# EAGLE design FidoComm (EAGLE 7.2.0)
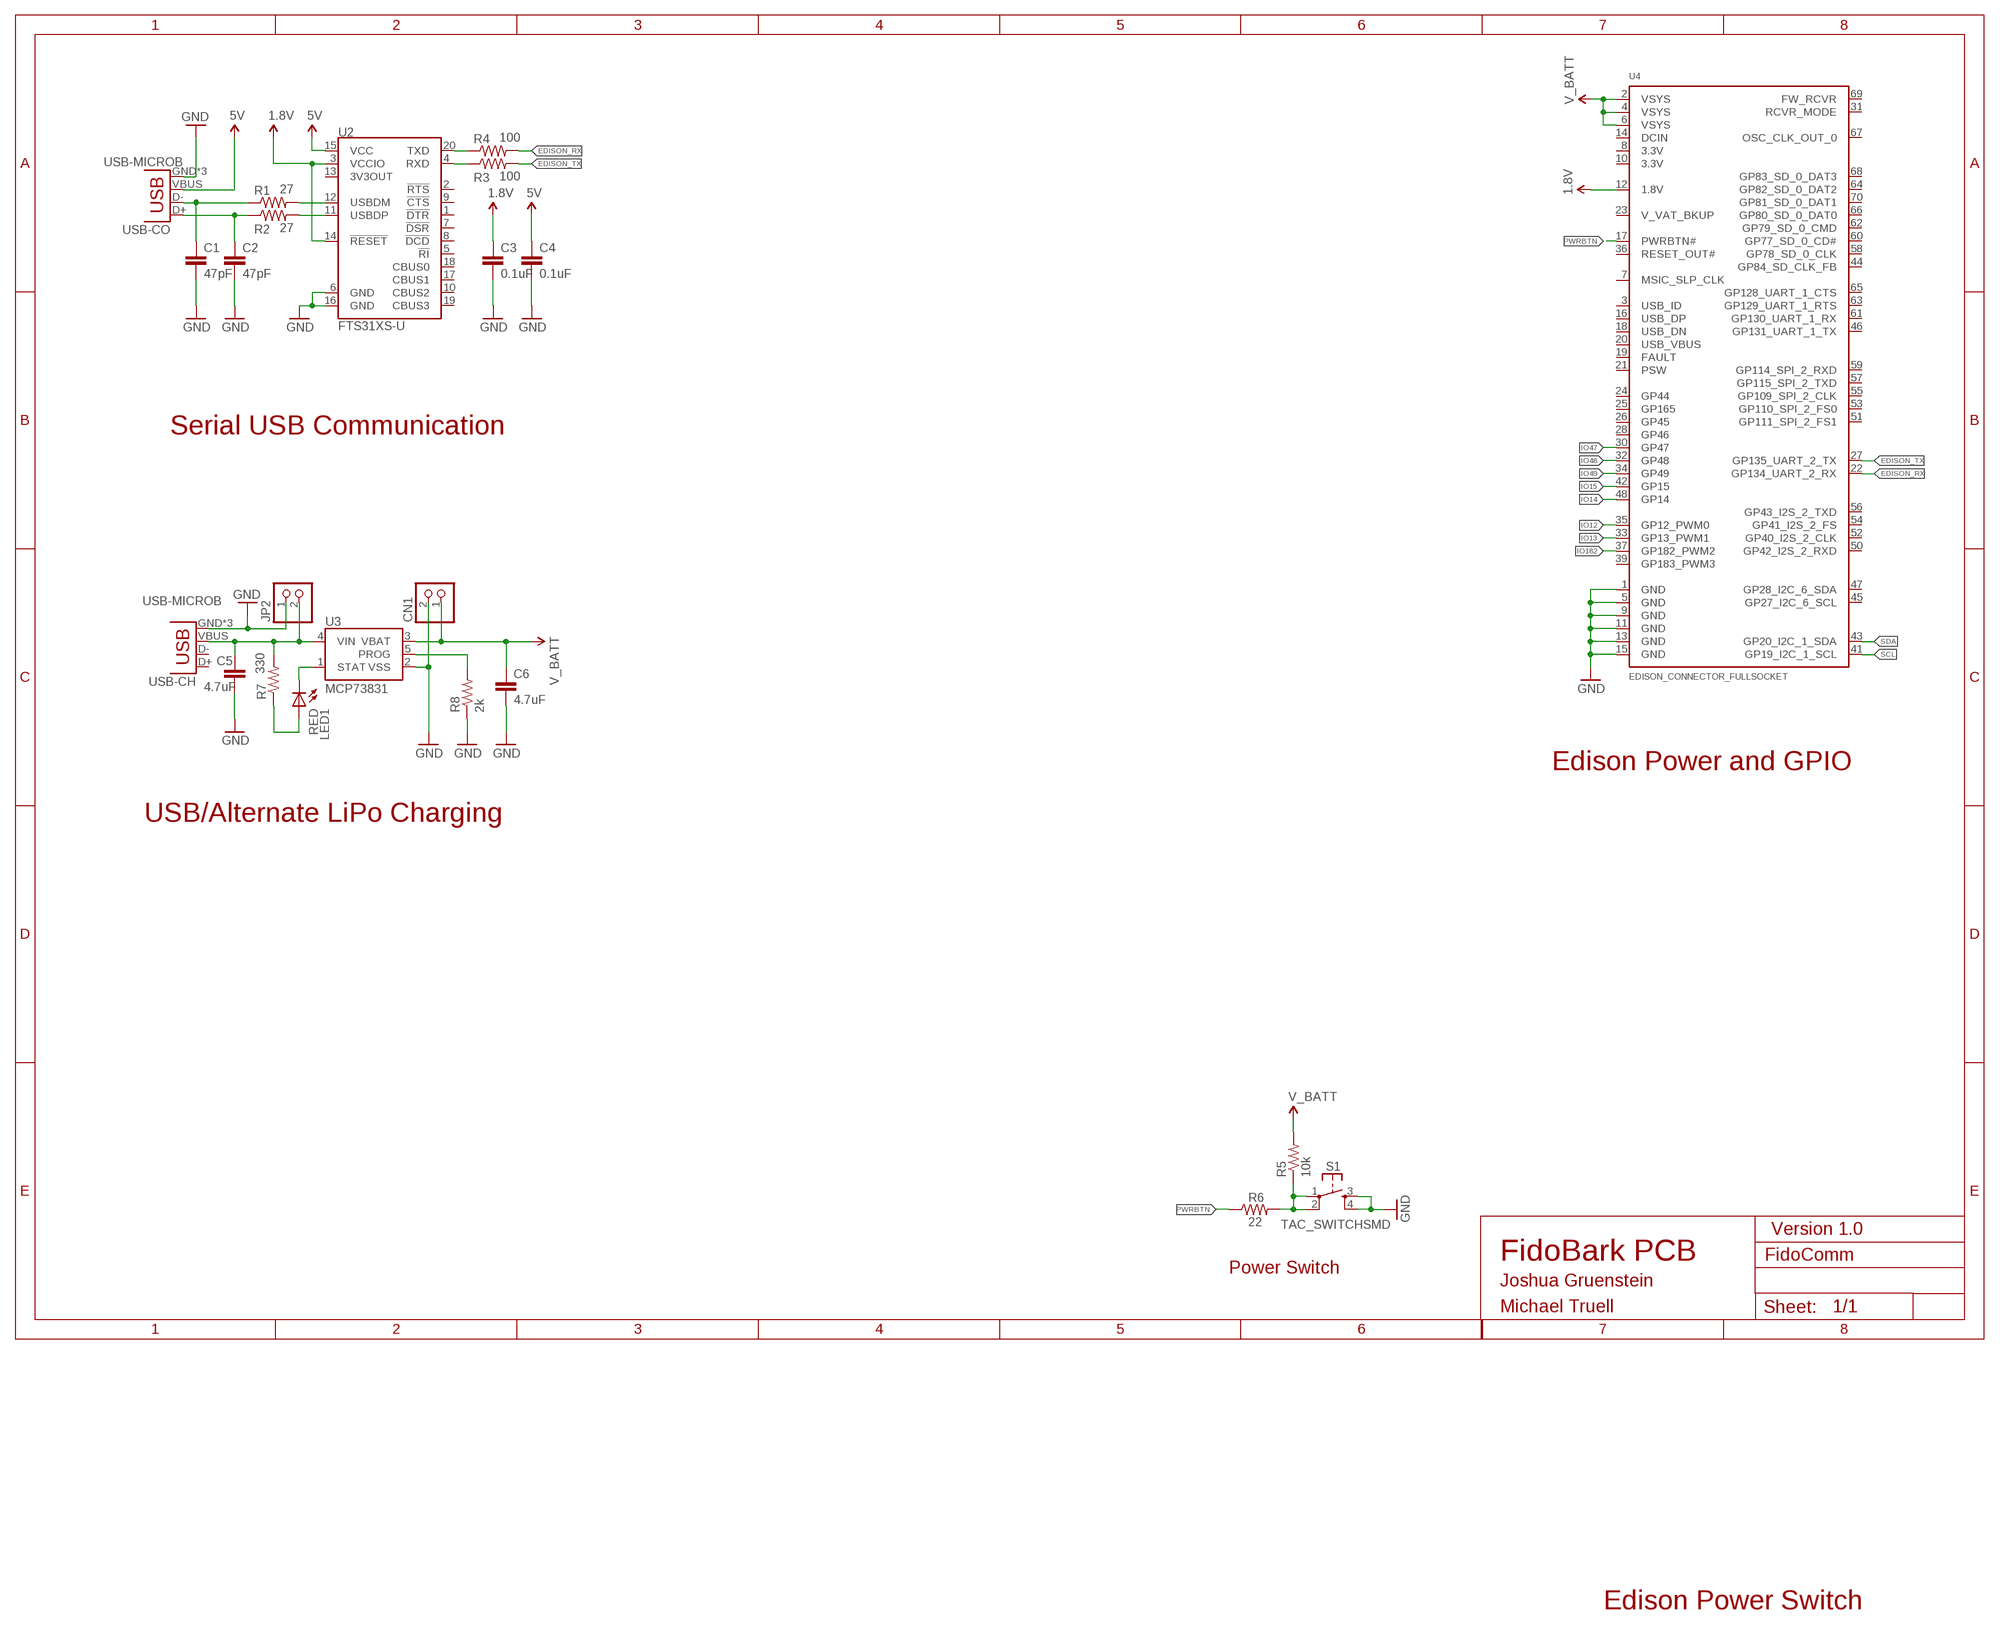
[diagram p0: schematic, sheet 1]

## Parts
C1  47pF  CAP0603-CAP  [0603-CAP]
C2  47pF  CAP0603-CAP  [0603-CAP]
C3  0.1uF  CAP0603-CAP  [0603-CAP]
C4  0.1uF  CAP0603-CAP  [0603-CAP]
C5  4.7uF  CAP0603-CAP  [0603-CAP]
C6  4.7uF  CAP0603-CAP  [0603-CAP]
CN1  JST_2PIN-SMT-RA  [JST-PH-2-SMT-RA]
JP2  PINHD-1X2  [1X02]
LED1  RED  LEDCHIP-LED0603  [CHIP-LED0603]
R1  27  R-US_R0603  [R0603]
R2  27  R-US_R0603  [R0603]
R3  100  R-US_R0603  [R0603]
R4  100  R-US_R0603  [R0603]
R5  10k  R-US_R0603  [R0603]
R6  22  R-US_R0603  [R0603]
R7  330  R-US_R0603  [R0603]
R8  2k  R-US_R0603  [R0603]
S1  TAC_SWITCHSMD  [TACTILE-SWITCH-SMD]
U2  FTS31XS-U  FT231XS  [SSOP20_L]
U3  MCP73831  [SOT23-5]
U4  EDISON_CONNECTOR_FULLSOCKET  [DF40-XC-(X.X)-70DS-0.4V(51)]
USB-CH  USB-MICROB  [USB-MICROB]
USB-CO  USB-MICROB  [USB-MICROB]

## Nets
1.8V: C3.1 U2.3(VCCIO) U2.14(!RESET) U4.12(1.8V)
5V: C4.1 U2.15(VCC) USB-CO.VBUS
EDISON_RX: R4.2 U4.22(GP134_UART_2_RX)
EDISON_TX: R3.2 U4.27(GP135_UART_2_TX)
GND: C1.2 C2.2 C3.2 C4.2 C5.2 C6.2 CN1.2 JP2.1 R8.1 S1.3 S1.4 U2.6(GND) U2.16(GND) U3.2(VSS) U4.1(GND) U4.5(GND) U4.9(GND) U4.11(GND) U4.13(GND) U4.15(GND) USB-CH.GND USB-CH.MT1(GND) USB-CH.MT2(GND) USB-CO.GND USB-CO.MT1(GND) USB-CO.MT2(GND)
IO12: U4.35(GP12_PWM0)
IO13: U4.33(GP13_PWM1)
IO14: U4.48(GP14)
IO15: U4.42(GP15)
IO47: U4.30(GP47)
IO48: U4.32(GP48)
IO49: U4.34(GP49)
IO182: U4.37(GP182_PWM2)
N$1: R2.2 U2.11(USBDP)
N$2: R1.2 U2.12(USBDM)
N$3: R3.1 U2.4(RXD)
N$4: C2.1 R2.1 USB-CO.D+
N$5: C1.1 R1.1 USB-CO.D-
N$6: R4.1 U2.20(TXD)
N$7: R5.1 R6.2 S1.1 S1.2
N$8: LED1.A R7.1
N$9: LED1.C U3.1(STAT)
N$10: R8.2 U3.5(PROG)
N$12: C5.1 JP2.2 R7.2 U3.4(VIN) USB-CH.VBUS
PWRBTN: R6.1 U4.17(PWRBTN#)
SCL: U4.41(GP19_I2C_1_SCL)
SDA: U4.43(GP20_I2C_1_SDA)
V_BATT: C6.1 CN1.1 R5.2 U3.3(VBAT) U4.2(VSYS) U4.4(VSYS) U4.6(VSYS)
Unconnected: U2.1(!DTR) U2.2(!RTS) U2.5(!RI) U2.7(!DSR) U2.8(!DCD) U2.9(!CTS) U2.10(CBUS2) U2.13(3V3OUT) U2.17(CBUS1) U2.18(CBUS0) U2.19(CBUS3) U4.3(USB_ID) U4.7(MSIC_SLP_CLK) U4.8(3.3V) U4.10(3.3V) U4.14(DCIN) U4.16(USB_DP) U4.18(USB_DN) U4.19(FAULT) U4.20(USB_VBUS) U4.21(PSW) U4.23(V_VAT_BKUP) U4.24(GP44) U4.25(GP165) U4.26(GP45) U4.28(GP46) U4.31(RCVR_MODE) U4.36(RESET_OUT#) U4.39(GP183_PWM3) U4.44(GP84_SD_CLK_FB) U4.45(GP27_I2C_6_SCL) U4.46(GP131_UART_1_TX) U4.47(GP28_I2C_6_SDA) U4.50(GP42_I2S_2_RXD) U4.51(GP111_SPI_2_FS1) U4.52(GP40_I2S_2_CLK) U4.53(GP110_SPI_2_FS0) U4.54(GP41_I2S_2_FS) U4.55(GP109_SPI_2_CLK) U4.56(GP43_I2S_2_TXD) U4.57(GP115_SPI_2_TXD) U4.58(GP78_SD_0_CLK) U4.59(GP114_SPI_2_RXD) U4.60(GP77_SD_0_CD#) U4.61(GP130_UART_1_RX) U4.62(GP79_SD_0_CMD) U4.63(GP129_UART_1_RTS) U4.64(GP82_SD_0_DAT2) U4.65(GP128_UART_1_CTS) U4.66(GP80_SD_0_DAT0) U4.67(OSC_CLK_OUT_0) U4.68(GP83_SD_0_DAT3) U4.69(FW_RCVR) U4.70(GP81_SD_0_DAT1) USB-CH.D+ USB-CH.D-

## Notes on the sheet
- Serial USB Communication
- Edison Power and GPIO
- USB/Alternate LiPo Charging
- Version 1.0
- FidoBark PCB
- Power Switch
- Joshua Gruenstein
- Michael Truell
- Edison Power Switch

## Library data of the parts
C1-C6 = SparkFun-Passives:CAP: Capacitor Standard 0603 ceramic capacitor, and 0.1" leaded capacitor.
CN1 = adafruit:JST_2PIN: JST 2-Pin Connectors of various flavors SMT-RA (S2B-PH-SM4) 4UConnector #17311 SMT (B2B-PH-SM4) THM-RA (S2B-PH) THM (B2B-PH)
JP2 = pinhead:PINHD-1X2: PIN HEADER
LED1 = adafruit:LED: LED OSRAM: - CHIPLED LG R971, LG N971, LY N971, LG Q971, LY Q971, LO R971, LY R971 LH N974, LH R974 LS Q976, LO Q976, LY Q976 LO Q996 - Hyper CHIPLED LW Q18S LB Q993, LB Q99A, LB R99A - SideLED LS A670, LO A670, LY A670, LG A670, LP A670 LB A673, LV A673, LT A673, LW A673 LH A674 LY A675 LS A676, LA A676, LO A676, LY A676, LW A676 LS A679, LY A679, LG A679 - Hyper Micro SIDELED® LS Y876, LA Y876, LO Y876, LY Y876 LT Y87S - SmartLED LW L88C, LW L88S LB L89C, LB L89S, LG L890 LS L89K, LO L89K, LY L89K LS L896, LA L896, LO L896, LY L896 - TOPLED LS T670, LO T670, LY T670, LG T670, LP T670 LSG T670, LSP T670, LSY T670, LOP T670, LYG T670 LG T671, LOG T671, LSG T671 LB T673, LV T673, LT T673, LW T673 LH T674 LS T676, LA T676, LO T676, LY T676, LB T676, LH T676, LSB T676, LW T676 LB T67C, LV T67C, LT T67C, LS T67K, LO T67K, LY T67K, LW E67C LS E67B, LA E67B, LO E67B, LY E67B, LB E67C, LV E67C, LT E67C LW T67C LS T679, LY T679, LG T679 LS T770, LO T770, LY T770, LG T770, LP T770 LB T773, LV T773, LT T773, LW T773 LH T774 LS E675, LA E675, LY E675, LS T675 LS T776, LA T776, LO T776, LY T776, LB T776 LHGB T686 LT T68C, LB T68C - Hyper Mini TOPLED® LB M676 - Mini TOPLED Santana® LG M470 LS M47K, LO M47K, LY M47K Source: http://www.osram.convergy.de/
R1-R8 = adafruit:R-US_: RESISTOR, American symbol
S1 = SparkFun-Retired:TAC_SWITCH: Momentary Switch Button commonly used for reset or general input. Spark Fun Electronics SKU : COM-00097 SMT- SWCH-08247; PROD_ID: SWCH-08247
U2 = SparkFun-DigitalIC:FT231X: FTDI FT231X Full Speed USB to Full-handshake UART This USB2.0 Full Speed IC offers a compact bridge to full handshake UART interfaces. The device is a UART, capable of operating up to 3MBaud, with low power consumption (8mA). The FT231X includes the complete FT-X series feature set and enables USB to be added into a system design quickly and easily over a UART interface.; PROD_ID: IC-11524
U3 = SparkFun-PowerIC:MCP73831: Miniature single cell, fully integrated Li-Ion, Li-polymer charge management controller http://ww1.microchip.com/downloads/en/DeviceDoc/20001984g.pdf IC-09995; PROD_ID: IC-09995
U4 = Edison:EDISON_CONNECTOR_FULL
USB-CH USB-CO = SparkFun-Connectors:USB: USB Connectors USB-B-PTH is fully proven SKU : PRT-00139/CONN-08278 USB-miniB is fully proven SKU : PRT-00587 USB-A-PCB is untested. USB-A-H is throughly reviewed, but untested. Spark Fun Electronics SKU : PRT-00437 USB-B-SMT is throughly reviewed, but untested. Needs silkscreen touching up. USB-A-S has not been used/tested USB-MB-H has not been used/tested USB-MICROB has been used. CONN-09505; PROD_ID: CONN-09505

## Board
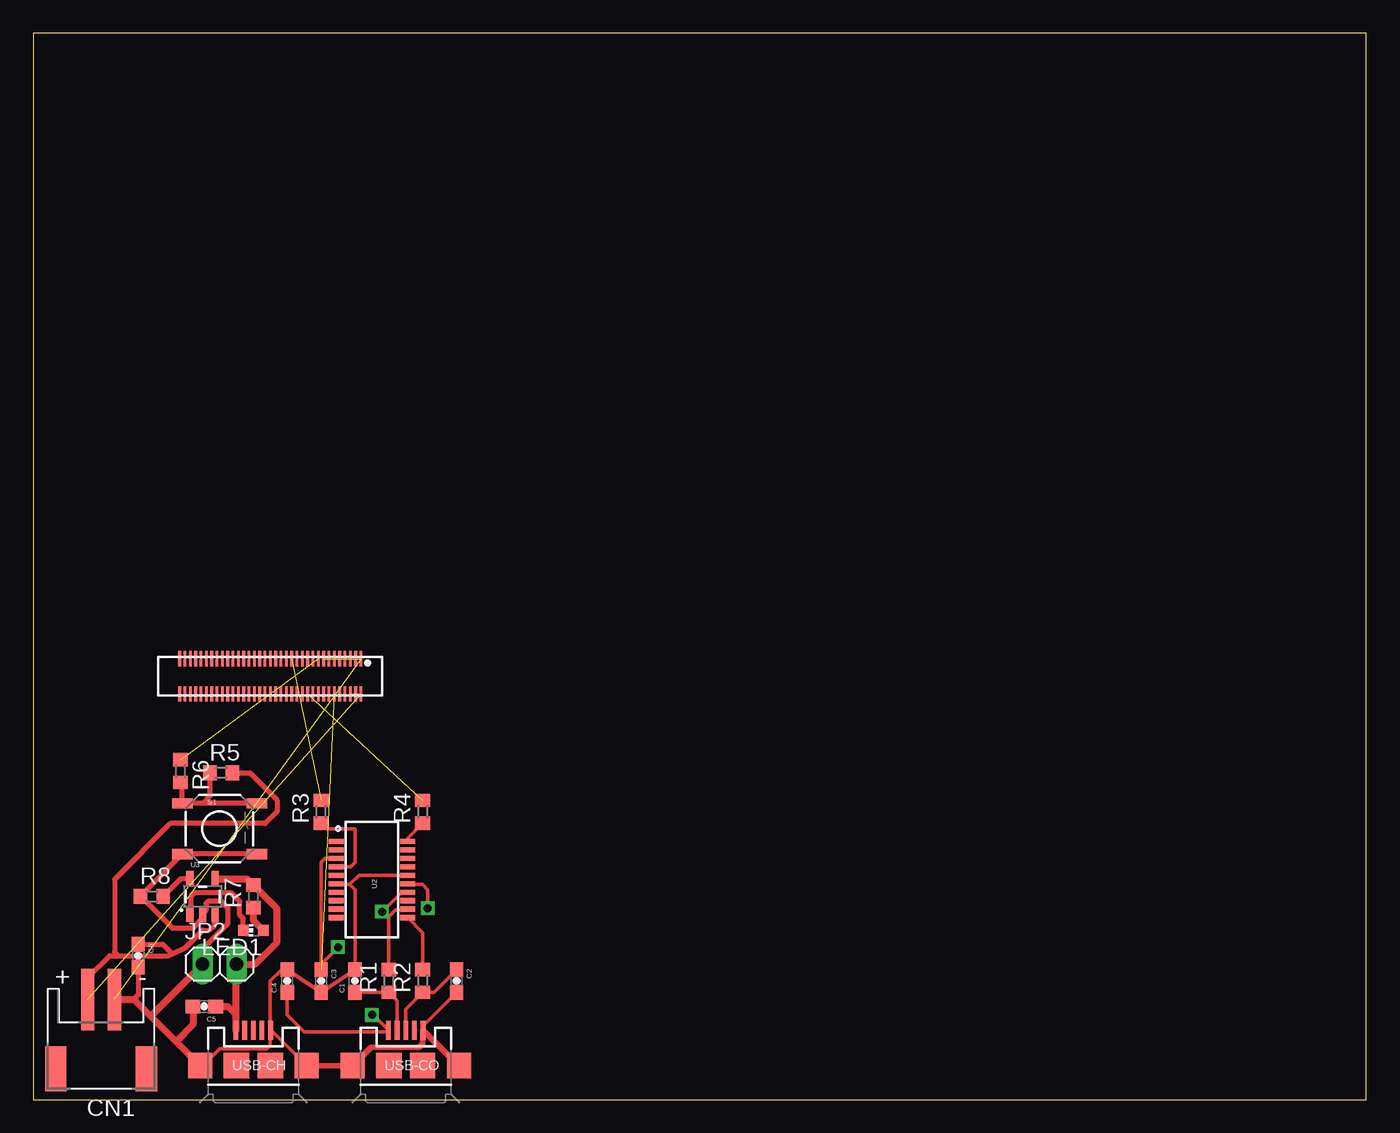
[diagram p1: board, top side]
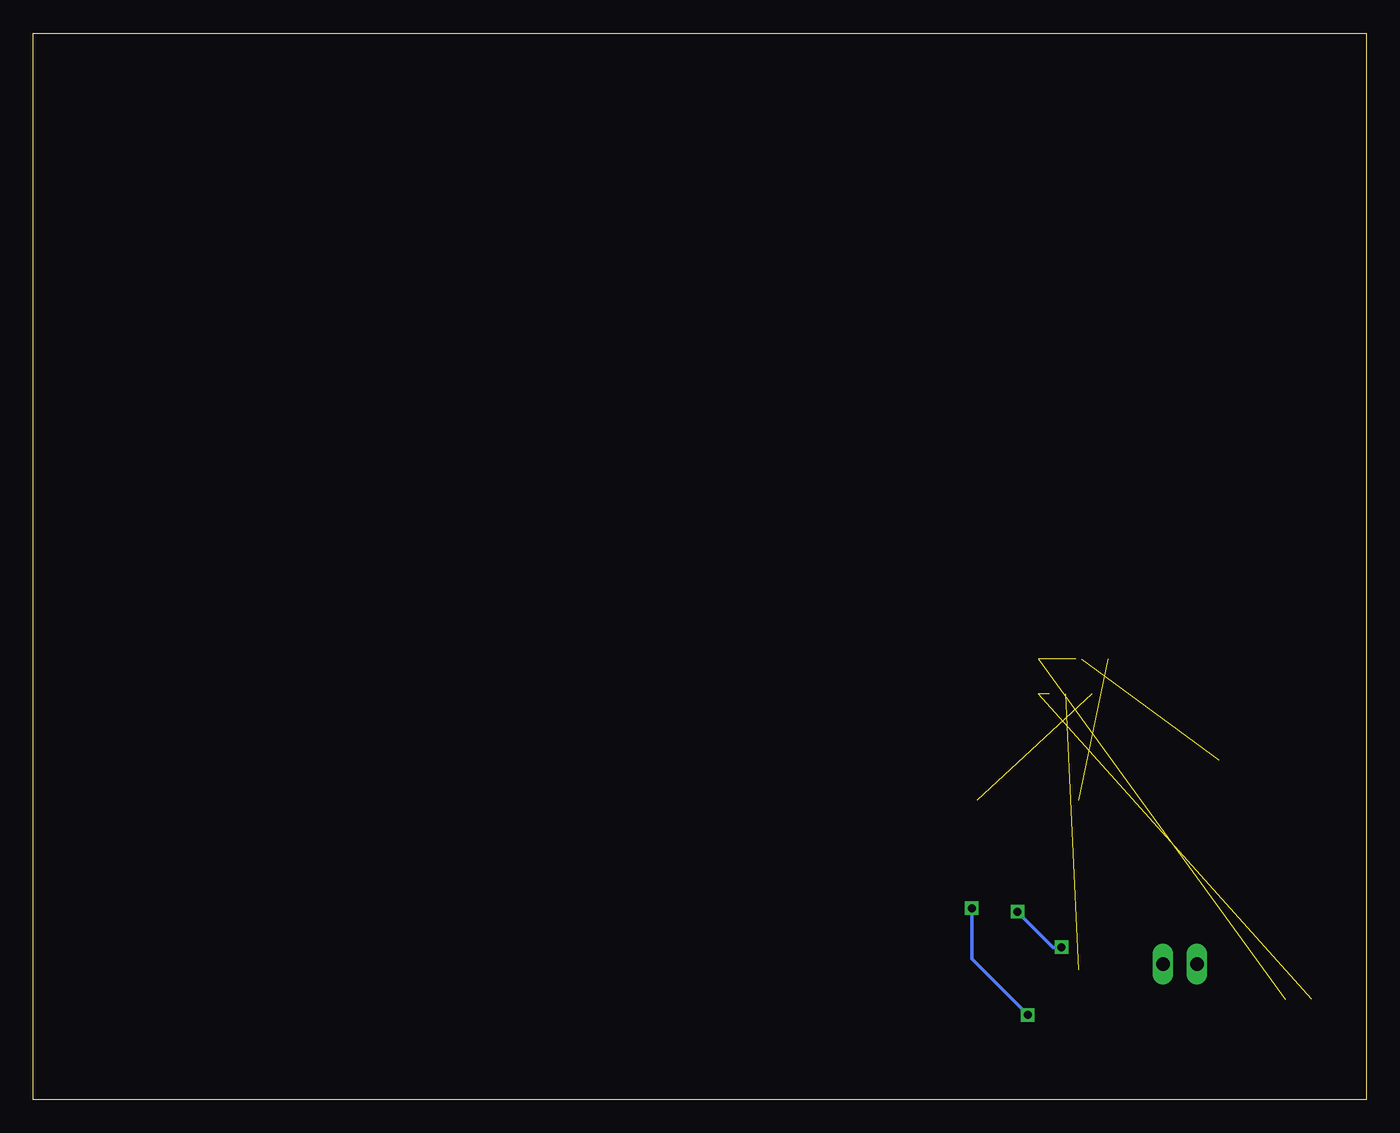
[diagram p2: board, bottom side, seen from below]

Size 100 x 80 mm. Coordinates in mm from the lower left corner, seen from the top.
Outline: 0,0 100,0 100,80 0,80 0,0
Copper layers (1*16): Top 0.035mm / dielectric 1.5mm / Bottom 0.035mm
Design rules "default": minimum track width 10mil, minimum drill 24mil, track to track 8mil, track to pad 8mil, pad to pad 8mil, via to via 8mil, smd to smd 8mil, copper to edge 40mil, drill to drill 8mil, minimum pad ring 10mil, minimum via ring 8mil, stop-mask expansion 4mil, vias tented up to drill 0mil, thermal gap 10mil

### Footprints (pad centres in the part's own frame; a part is rotated, then mirrored left to right if it is on the bottom)
0603-CAP = smd 1.1 x 1: 1 -0.85,0; 2 0.85,0
JST-PH-2-SMT-RA = smd 1 x 4.6: 1 1,-3.7; 2 -1,-3.7 | smd 1.6 x 3.4: NC1 -3.4,1.5; NC2 3.4,1.5
1X02 = drill 1.016 long: 1 -1.27,0; 2 1.27,0
CHIP-LED0603 = smd 0.8 x 0.8: A 0,-0.75; C 0,0.75
R0603 = smd 1 x 1.1: 1 -0.85,0; 2 0.85,0
TACTILE-SWITCH-SMD = smd 1.524 x 0.762: 1 -2.794,1.905; 2 2.794,1.905; 3 -2.794,-1.905; 4 2.794,-1.905
SSOP20_L = smd 0.381 x 1.143: 1 -2.857,-2.68; 2 -2.223,-2.68; 3 -1.587,-2.68; 4 -0.953,-2.68; 5 -0.318,-2.68; 6 0.318,-2.68; 7 0.953,-2.68; 8 1.587,-2.68; 9 2.223,-2.68; 10 2.857,-2.68; 11 2.857,2.68; 12 2.223,2.68; 13 1.587,2.68; 14 0.953,2.68; 15 0.318,2.68; 16 -0.318,2.68; 17 -0.953,2.68; 18 -1.587,2.68; 19 -2.223,2.68; 20 -2.857,2.68
SOT23-5 = smd 0.55 x 1.2: 1 -0.95,-1.3; 2 0,-1.3; 3 0.95,-1.3; 4 0.95,1.3; 5 -0.95,1.3
DF40-XC-(X.X)-70DS-0.4V(51) = smd 0.2 x 1.14: 1 6.8,1.32; 2 6.8,-1.32; 3 6.4,1.32; 4 6.4,-1.32; 5 6,1.32; 6 6,-1.32; 7 5.6,1.32; 8 5.6,-1.32; 9 5.2,1.32; 10 5.2,-1.32; 11 4.8,1.32; 12 4.8,-1.32; 13 4.4,1.32; 14 4.4,-1.32; 15 4,1.32; 16 4,-1.32; 17 3.6,1.32; 18 3.6,-1.32; 19 3.2,1.32; 20 3.2,-1.32; 21 2.8,1.32; 22 2.8,-1.32; 23 2.4,1.32; 24 2.4,-1.32; 25 2,1.32; 26 2,-1.32; 27 1.6,1.32; 28 1.6,-1.32; 29 1.2,1.32; 30 1.2,-1.32; 31 0.8,1.32; 32 0.8,-1.32; 33 0.4,1.32; 34 0.4,-1.32; 35 0,1.32; 36 0,-1.32; 37 -0.4,1.32; 38 -0.4,-1.32; 39 -0.8,1.32; 40 -0.8,-1.32; 41 -1.2,1.32; 42 -1.2,-1.32; 43 -1.6,1.32; 44 -1.6,-1.32; 45 -2,1.32; 46 -2,-1.32; 47 -2.4,1.32; 48 -2.4,-1.32; 49 -2.8,1.32; 50 -2.8,-1.32; 51 -3.2,1.32; 52 -3.2,-1.32; 53 -3.6,1.32; 54 -3.6,-1.32; 55 -4,1.32; 56 -4,-1.32; 57 -4.4,1.32; 58 -4.4,-1.32; 59 -4.8,1.32; 60 -4.8,-1.32; 61 -5.2,1.32; 62 -5.2,-1.32; 63 -5.6,1.32; 64 -5.6,-1.32; 65 -6,1.32; 66 -6,-1.32; 67 -6.4,1.32; 68 -6.4,-1.32; 69 -6.8,1.32; 70 -6.8,-1.32
USB-MICROB = smd 0.35 x 1.4: D+ 0,2.65; D- -0.65,2.65; GND 1.3,2.65; ID 0.65,2.65; VBUS -1.3,2.65 | smd 1.8 x 1.9: MT1 -4,0; MT2 4,0 | smd 1.9 x 1.9: P$1 -1.27,0; P$2 1.27,0

### Placement (x,y rotation side)
C1  24.13,8.89 90 top
C2  31.75,8.89 270 top
C3  21.59,8.89 270 top
C4  19.05,8.89 90 top
C5  12.83,6.99 180 top
C6  7.87,10.79 270 top
CN1  5.08,3.81 180 top
JP2  13.97,10.16 0 top
LED1  16.51,12.7 90 top
R1  26.67,8.89 90 top
R2  29.21,8.89 90 top
R3  21.59,21.59 90 top
R4  29.21,21.59 90 top
R5  14.1,24.51 0 top
R6  11.05,24.64 270 top
R7  16.51,15.24 90 top
R8  8.89,15.24 0 top
S1  13.97,20.32 0 top
U2  25.4,16.51 270 top
U3  12.7,15.24 0 top
U4  17.78,31.75 0 top
USB-CH  16.51,2.54 0 top
USB-CO  27.94,2.54 0 top

### Tracks (layer width: path | path; a pad name or v marks a point on that pad's centre or on a via)
1.8V  (via drill 0.6)  (1 unrouted)
  Top 0.254: v22.86,11.43 21.59,10.16 C3.1 21.59,17.78 21.91,18.1 U2.3 | v26.16,14.1 27.62,15.56 U2.14
  Bottom 0.254: v22.86,11.43 23.5,11.43 v26.16,14.1
5V  (via drill 0.6)
  Top 0.254: C4.1 19.05,6.35 20.32,5.08 26.53,5.08 USB-CO.VBUS 25.48,6.35 v25.4,6.35 | v29.59,14.35 29.59,15.75 29.21,16.13 28.14,16.13 U2.15
  Bottom 0.254: v25.4,6.35 29.59,10.54 v29.59,14.35
EDISON_RX  (1 unrouted)
EDISON_TX  (1 unrouted)
GND  (6 unrouted)
  Top 0.254: USB-CO.GND 29.24,5.53 C2.2 | USB-CH.GND 17.78,5.22 17.78,8.89 18.63,9.74 C4.2 C3.2 C1.2 24.13,15.75 23.75,16.13 | USB-CH.GND 17.86,5.19 USB-CH.MT2 | USB-CH.MT1 12.7,2.54 13.97,3.81 17.53,3.81 17.78,4.06 17.78,5.16 USB-CH.GND | 23.75,16.13 22.78,16.13 U2.6 | U2.16 24.45,16.83 23.75,16.13
  Top 0.381: JP2.1 12.7,11.3 14.61,13.21 14.61,14.35 14.1,14.86 13.08,14.86 12.95,14.73 12.95,14.19 U3.2 12.7,13.59 11.94,12.83 10.45,12.83 R8.1 8.04,15.28 S1.3 S1.4 | C6.2 7.87,7.84 7.54,7.51
  Top 0.406: USB-CO.MT2 31.89,2.54 USB-CO.GND 29.21,5.16 29.21,4.19 28.96,3.94 25.34,3.94 USB-CO.MT1 USB-CH.MT2
  Top 0.508: CN1.2 7.54,7.51 8.79,6.25 | 8.79,6.25 10.7,4.35 | 10.7,4.35 USB-CH.MT1 | JP2.1 8.79,6.25 | C5.2 11.98,5.63 10.7,4.35
N$1
  Top 0.254: R2.2 29.21,12.52 U2.11
N$2
  Top 0.254: R1.2 26.67,13.72 27.18,14.22 28.02,14.22 U2.12
N$3
  Top 0.254: U2.4 23.81,17.46 24.13,17.78 24.13,20.32 22.01,20.32 R3.1
N$4
  Top 0.254: C2.1 30.05,8.04 R2.1 27.94,6.77 USB-CO.D+
N$5
  Top 0.254: C1.1 R1.1 27.29,7.42 USB-CO.D-
N$6
  Top 0.254: U2.20 28.08,19.61 R4.1
N$7
  Top 0.381: R6.2 11.18,23.66 S1.1 12.7,22.23 | S1.2 12.7,22.23 | R5.1 13.25,22.77 12.7,22.23
N$8
  Top 0.508: R7.1 16.51,13.45 LED1.A
N$9
  Top 0.381: LED1.C 15.76,13.58 15.49,13.84 15.49,14.86 14.86,15.49 12.06,15.49 11.81,15.24 11.81,14 U3.1
N$10
  Top 0.381: U3.5 11.04,16.54 R8.2
N$12
  Top 0.508: USB-CH.VBUS 15.21,6.35 | 15.21,6.35 15.21,8.86 JP2.2 16.64,10.16 18.29,11.81 18.29,14.31 R7.2 16.06,16.54 U3.4 | C5.1 14.57,6.99 15.21,6.35
PWRBTN  (1 unrouted)
V_BATT  (3 unrouted)
  Top 0.381: U3.3 13.59,13.88 13.59,13.08 13.21,12.7 12.7,12.7 11.43,11.43 10.41,10.92 | CN1.1 4.08,9.16 5.71,10.79 6.35,10.79 | 6.35,10.79 10.16,10.79 10.41,10.92 | C6.1 9.69,11.64 10.41,10.92 | R5.2 16.26,24.51 18.29,22.48 18.29,21.59 17.4,20.7 10.29,20.7 6.1,16.51 6.1,11.05 6.35,10.79